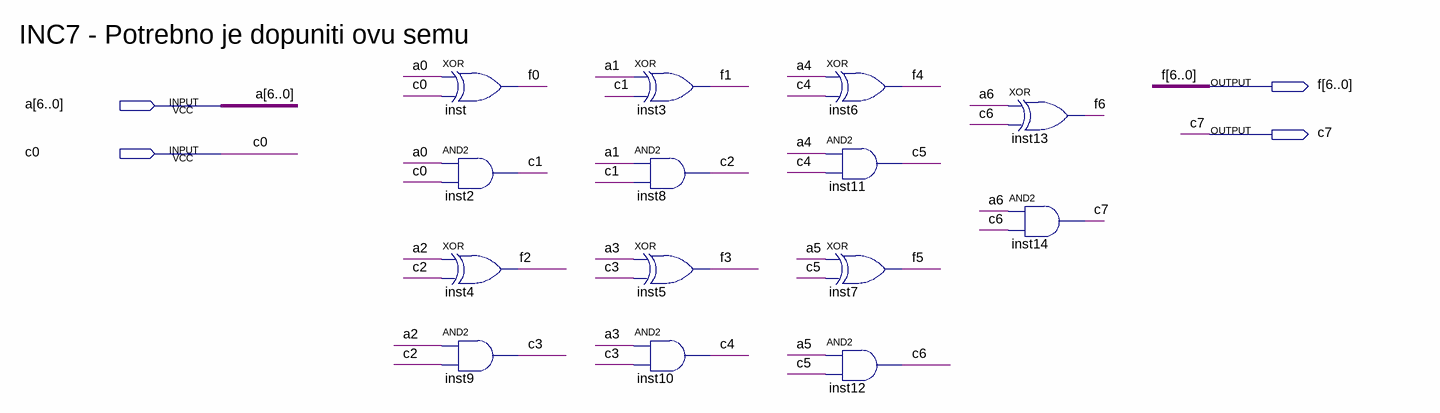
[diagram p0: schematic sheet]
// Quartus schematic INC7.bdf as structural Verilog: 14 symbols, 4 pins
module INC7 (
  input  [6:0] a,
  input  c0,
  output [6:0] f,
  output c7
);

  wire c1, c2, c3, c4, c5, c6;

  xor inst (f[0], a[0], c0);
  and inst2 (c1, a[0], c0);
  xor inst4 (f[2], a[2], c2);
  and inst9 (c3, a[2], c2);
  xor inst3 (f[1], a[1], c1);
  and inst8 (c2, a[1], c1);
  xor inst5 (f[3], a[3], c3);
  and inst10 (c4, a[3], c3);
  xor inst6 (f[4], a[4], c4);
  and inst11 (c5, a[4], c4);
  xor inst7 (f[5], a[5], c5);
  and inst12 (c6, a[5], c5);
  xor inst13 (f[6], a[6], c6);
  and inst14 (c7, a[6], c6);

  // Notes on the sheet:
  //   INC7 - Potrebno je dopuniti ovu semu
endmodule
